# Altium schematic sheet edge_dff_clk_low.SchDoc
size A4
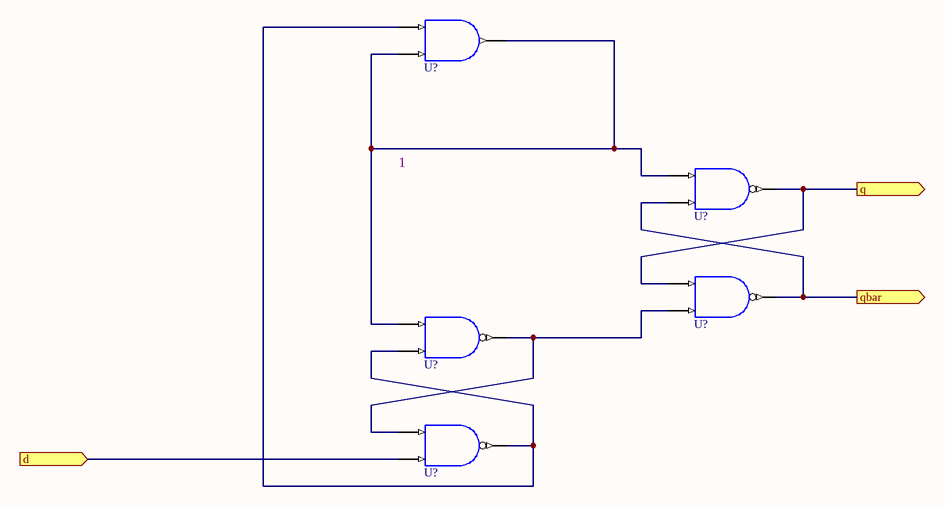
[diagram p0: edge_dff_clk_low.SchDoc]

## Parts
(Parts that share a designator on the sheet are numbered #1, #2 ... from top to bottom, then left to right.)
U?#1  AND 2  (value not drawn)
U?#2  AND 2  (value not drawn)
U?#3  AND 2  (value not drawn)
U?#4  AND 2  (value not drawn)
U?#5  AND 2  (value not drawn)

## Ports
d (in), q (out), qbar (out)

## Nets
d: U?#5.B ; port d
q: U?#2.Y U?#3.A ; port q
qbar: U?#2.B U?#3.Y ; port qbar
NetU?#1_A: U?#1.A U?#4.B U?#5.Y
NetU?#1_B: U?#1.B U?#1.Y U?#2.A U?#4.A
NetU?#3_B: U?#3.B U?#4.Y U?#5.A

## Notes on the sheet
- 1

## Library data of the parts
U?#1-U?#5 = AND_2: 2 Input AND